# EAGLE design bff-v0 (EAGLE 7.4.0)
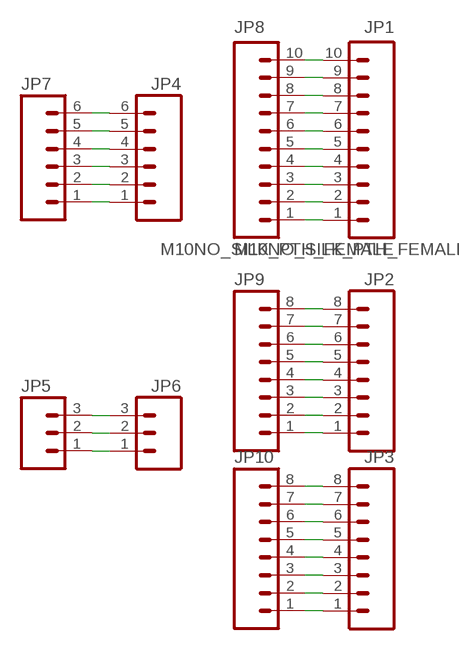
[diagram p0: schematic, sheet 1]

## Parts
JP1  M10NO_SILK_PTH_FEMALE  [1X10_NO_SILK]
JP2  M08NO_SILK_FEMALE_PTH  [1X08_NO_SILK]
JP3  M08NO_SILK_FEMALE_PTH  [1X08_NO_SILK]
JP4  M06NO_SILK_FEMALE_PTH  [1X06_NO_SILK]
JP5  M03LOCK_NO_SILK  [1X03_LOCK_NO_SILK]
JP6  M03PTH  [1X03]
JP7  M06NO_SILK_FEMALE_PTH  [1X06_NO_SILK]
JP8  M10NO_SILK_PTH_FEMALE  [1X10_NO_SILK]
JP9  M08NO_SILK_FEMALE_PTH  [1X08_NO_SILK]
JP10  M08NO_SILK_FEMALE_PTH  [1X08_NO_SILK]

## Nets
N$1: JP5.1 JP6.1
N$2: JP5.2 JP6.2
N$3: JP5.3 JP6.3
N$4: JP4.1 JP7.1
N$5: JP4.2 JP7.2
N$6: JP4.3 JP7.3
N$7: JP4.4 JP7.4
N$8: JP4.5 JP7.5
N$9: JP4.6 JP7.6
N$10: JP1.1 JP8.1
N$11: JP1.2 JP8.2
N$12: JP1.3 JP8.3
N$13: JP1.4 JP8.4
N$14: JP1.5 JP8.5
N$15: JP1.6 JP8.6
N$16: JP1.7 JP8.7
N$17: JP1.8 JP8.8
N$18: JP1.9 JP8.9
N$19: JP1.10 JP8.10
N$20: JP2.1 JP9.1
N$21: JP2.2 JP9.2
N$22: JP2.3 JP9.3
N$23: JP2.4 JP9.4
N$24: JP2.5 JP9.5
N$25: JP2.6 JP9.6
N$26: JP2.7 JP9.7
N$27: JP2.8 JP9.8
N$28: JP3.1 JP10.1
N$29: JP3.2 JP10.2
N$30: JP3.3 JP10.3
N$31: JP3.4 JP10.4
N$32: JP3.5 JP10.5
N$33: JP3.6 JP10.6
N$34: JP3.7 JP10.7
N$35: JP3.8 JP10.8

## Library data of the parts
JP1 JP8 = SparkFun-Connectors:M10: Header 10 Standard 10-pin 0.1" header. Use with straight break away headers (SKU : PRT-00116), right angle break away headers (PRT-00553), swiss pins (PRT-00743), machine pins (PRT-00117), and female headers (PRT-00115).; PROD_ID: CONN-11563
JP2 JP3 JP9 JP10 = SparkFun-Connectors:M08: Header 8 Standard 8-pin 0.1" header. Use with straight break away headers (SKU : PRT-00116), right angle break away headers (PRT-00553), swiss pins (PRT-00743), machine pins (PRT-00117), and female headers (PRT-00115).; PROD_ID: CONN-08438
JP4 JP7 = SparkFun-Connectors:M06: Header 6 Standard 6-pin 0.1" header. Use with straight break away headers (SKU : PRT-00116), right angle break away headers (PRT-00553), swiss pins (PRT-00743), machine pins (PRT-00117), and female headers (PRT-00115). Molex polarized connector foot print use with SKU : PRT-08094 with associated crimp pins and housings. NOTES ON THE VARIANTS LOCK and LOCK_LONGPADS... This footprint was designed to help hold the alignment of a through-hole component (i.e. 6-pin header) while soldering it into place. You may notice that each hole has been shifted either up or down by 0.005 of an inch from it's more standard position (which is a perfectly straight line). This slight alteration caused the pins (the squares in the middle) to touch the edges of the holes. Because they are alternating, it causes a "brace" to hold the component in place. 0.005 has proven to be the perfect amount of "off-center" position when using our standard breakaway headers. Although looks a little odd when you look at the bare footprint, once you have a header in there, the alteration is very hard to notice. Also,if you push a header all the way into place, it is covered up entirely on the bottom side. This idea of altering the position of holes to aid alignment will be further integrated into the Sparkfun Library for other footprints. It can help hold any component with 3 or more connection pins.; PROD_ID: CONN-08437
JP5 JP6 = SparkFun-Connectors:M03: Header 3 Standard 3-pin 0.1" header. Use with straight break away headers (SKU : PRT-00116), right angle break away headers (PRT-00553), swiss pins (PRT-00743), machine pins (PRT-00117), and female headers (PRT-00115). Molex polarized connector foot print use with SKU : PRT-08232 with associated crimp pins and housings.

## Board
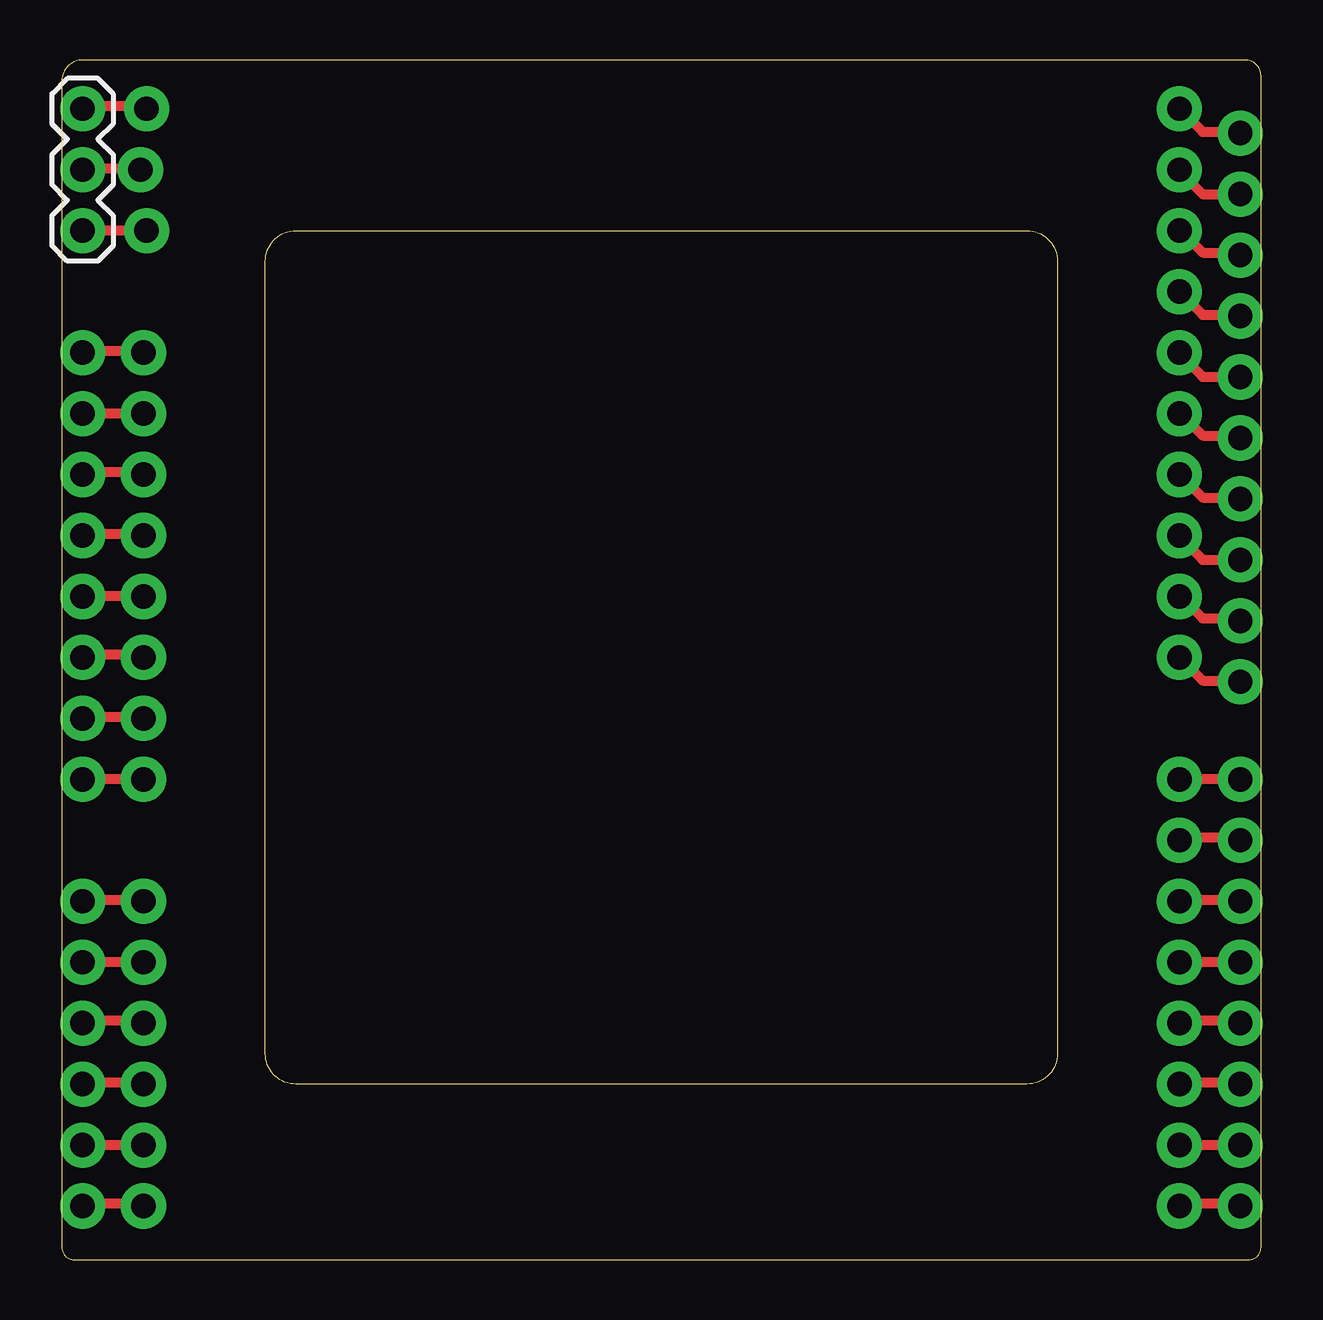
[diagram p1: board, top side]

Size 49.99 x 49.99 mm. Coordinates in mm from the lower left corner, seen from the top.
Outline: 49.34,49.99 0.86,49.99 arc90 0,49.12 0,0.51 arc90 0.51,0 49.48,0 arc90 49.99,0.51 49.99,49.34 arc90 49.34,49.99
Outline: 8.48,8.59 8.48,41.61 arc-90 9.75,42.88 40.23,42.88 arc-90 41.5,41.61 41.5,8.59 arc-90 40.23,7.32 9.75,7.32 arc-90 8.48,8.59
Copper layers (1*16): Top 0.035mm / dielectric 1.5mm / Bottom 0.035mm
Design rules "ITEADstudio_DRC": minimum track width 6mil, minimum drill 12mil, track to track 6mil, track to pad 6mil, pad to pad 6mil, via to via 6mil, smd to smd 0mil, copper to edge 10mil, drill to drill 10mil, minimum pad ring 10mil, minimum via ring 6mil, stop-mask expansion 2mil, vias tented up to drill 100mil, thermal gap 10mil

### Footprints (pad centres in the part's own frame; a part is rotated, then mirrored left to right if it is on the bottom)
1X10_NO_SILK = drill 1.016 pad 1.88: 1 0,0; 2 2.54,0; 3 5.08,0; 4 7.62,0; 5 10.16,0; 6 12.7,0; 7 15.24,0; 8 17.78,0; 9 20.32,0; 10 22.86,0
1X08_NO_SILK = drill 1.016 pad 1.88: 1 0,0; 2 2.54,0; 3 5.08,0; 4 7.62,0; 5 10.16,0; 6 12.7,0; 7 15.24,0; 8 17.78,0
1X06_NO_SILK = drill 1.016 pad 1.88: 1 0,0; 2 2.54,0; 3 5.08,0; 4 7.62,0; 5 10.16,0; 6 12.7,0
1X03_LOCK_NO_SILK = drill 1.016 pad 1.88: 1 0,0.127; 2 2.54,-0.127; 3 5.08,0.127
1X03 = drill 1.016 pad 1.88: 1 0,0; 2 2.54,0; 3 5.08,0

### Placement (x,y rotation side)
JP1  46.58,47.96 270 top
JP2  46.58,20.02 270 top
JP3  3.4,37.8 270 top
JP4  3.4,14.94 270 top
JP5  3.4,47.96 270 top
JP6  0.86,47.96 270 top
JP7  0.86,14.94 270 top
JP8  49.12,46.94 270 top
JP9  49.12,20.02 270 top
JP10  0.86,37.8 270 top

### Tracks (layer width: path | path; a pad name or v marks a point on that pad's centre or on a via)
N$1
  Top 0.152: 0.91,48.06 JP6.1 | 3.51,48.06 JP5.1
  Top 0.406: 3.51,48.06 0.91,48.06
N$2
  Top 0.152: 0.91,45.47 JP6.2 | 3.2,45.47 JP5.2
  Top 0.406: 3.2,45.47 0.91,45.47
N$3
  Top 0.152: 0.91,42.88 JP6.3 | 3.51,42.88 JP5.3
  Top 0.406: 3.51,42.88 0.91,42.88
N$4
  Top 0.152: 0.91,14.99 JP7.1 | 3.35,14.99 JP4.1
  Top 0.406: 3.35,14.99 0.91,14.99
N$5
  Top 0.152: 0.91,12.4 JP7.2 | 3.35,12.4 JP4.2
  Top 0.406: 3.35,12.4 0.91,12.4
N$6
  Top 0.152: 0.91,9.96 JP7.3 | 3.35,9.96 JP4.3
  Top 0.406: 3.35,9.96 0.91,9.96
N$7
  Top 0.152: 0.91,7.37 JP7.4 | 3.35,7.37 JP4.4
  Top 0.406: 3.35,7.37 0.91,7.37
N$8
  Top 0.152: 0.91,4.78 JP7.5 | 3.35,4.78 JP4.5
  Top 0.406: 3.35,4.78 0.91,4.78
N$9
  Top 0.152: 0.91,2.34 JP7.6 | 3.35,2.34 JP4.6
  Top 0.406: 3.35,2.34 0.91,2.34
N$10
  Top 0.152: 49.07,46.99 JP8.1 | 46.63,47.9 JP1.1
  Top 0.406: 49.07,46.99 47.55,46.99 46.63,47.9
N$11
  Top 0.152: 49.07,44.4 JP8.2 | 46.63,45.31 JP1.2
  Top 0.406: 49.07,44.4 47.55,44.4 46.63,45.31
N$12
  Top 0.152: 49.07,41.96 JP8.3 | 46.63,42.88 JP1.3
  Top 0.406: 49.07,41.96 47.55,41.96 46.63,42.88
N$13
  Top 0.152: 49.07,39.37 JP8.4 | 46.63,40.28 JP1.4
  Top 0.406: 49.07,39.37 47.55,39.37 46.63,40.28
N$14
  Top 0.152: 49.07,36.78 JP8.5 | 46.63,37.69 JP1.5
  Top 0.406: 49.07,36.78 47.55,36.78 46.63,37.69
N$15
  Top 0.152: 49.07,34.34 JP8.6 | 46.63,35.26 JP1.6
  Top 0.406: 49.07,34.34 47.55,34.34 46.63,35.26
N$16
  Top 0.152: 49.07,31.75 JP8.7 | 46.63,32.66 JP1.7
  Top 0.406: 49.07,31.75 47.55,31.75 46.63,32.66
N$17
  Top 0.152: 49.07,29.16 JP8.8 | 46.63,30.07 JP1.8
  Top 0.406: 49.07,29.16 47.55,29.16 46.63,30.07
N$18
  Top 0.152: 49.07,26.72 JP8.9 | 46.63,27.64 JP1.9
  Top 0.406: 49.07,26.72 47.55,26.72 46.63,27.64
N$19
  Top 0.152: 49.07,24.13 JP8.10 | 46.63,25.04 JP1.10
  Top 0.406: 49.07,24.13 47.55,24.13 46.63,25.04
N$20
  Top 0.152: 46.63,20.02 JP2.1 | 49.07,20.02 JP9.1
  Top 0.406: 49.07,20.02 46.63,20.02
N$21
  Top 0.152: 46.63,17.58 JP2.2 | 49.07,17.58 JP9.2
  Top 0.406: 49.07,17.58 46.63,17.58
N$22
  Top 0.152: 46.63,14.99 JP2.3 | 49.07,14.99 JP9.3
  Top 0.406: 49.07,14.99 46.63,14.99
N$23
  Top 0.152: 46.63,12.4 JP2.4 | 49.07,12.4 JP9.4
  Top 0.406: 49.07,12.4 46.63,12.4
N$24
  Top 0.152: 46.63,9.96 JP2.5 | 49.07,9.96 JP9.5
  Top 0.406: 49.07,9.96 46.63,9.96
N$25
  Top 0.152: 46.63,7.37 JP2.6 | 49.07,7.37 JP9.6
  Top 0.406: 49.07,7.37 46.63,7.37
N$26
  Top 0.152: 46.63,4.78 JP2.7 | 49.07,4.78 JP9.7
  Top 0.406: 49.07,4.78 46.63,4.78
N$27
  Top 0.152: 46.63,2.34 JP2.8 | 49.07,2.34 JP9.8
  Top 0.406: 49.07,2.34 46.63,2.34
N$28
  Top 0.152: 0.91,37.85 JP10.1 | 3.35,37.85 JP3.1
  Top 0.406: 3.35,37.85 0.91,37.85
N$29
  Top 0.152: 0.91,35.26 JP10.2 | 3.35,35.26 JP3.2
  Top 0.406: 3.35,35.26 0.91,35.26
N$30
  Top 0.152: 0.91,32.82 JP10.3 | 3.35,32.82 JP3.3
  Top 0.406: 3.35,32.82 0.91,32.82
N$31
  Top 0.152: 0.91,30.23 JP10.4 | 3.35,30.23 JP3.4
  Top 0.406: 3.35,30.23 0.91,30.23
N$32
  Top 0.152: 0.91,27.64 JP10.5 | 3.35,27.64 JP3.5
  Top 0.406: 3.35,27.64 0.91,27.64
N$33
  Top 0.152: 0.91,25.2 JP10.6 | 3.35,25.2 JP3.6
  Top 0.406: 3.35,25.2 0.91,25.2
N$34
  Top 0.152: 0.91,22.61 JP10.7 | 3.35,22.61 JP3.7
  Top 0.406: 3.35,22.61 0.91,22.61
N$35
  Top 0.152: 0.91,20.02 JP10.8 | 3.35,20.02 JP3.8
  Top 0.406: 3.35,20.02 0.91,20.02